# Altium schematic sheet Game_Consol_Power.SchDoc: Schematic_Name
size A4; CompanyName: University of Melbourne; DrawnBy: Student_#; Engineer: Your Name Here; Organization: University of Melbourne; DocumentNumber: 1; Revision: 0.1; SheetNumber: 1; SheetTotal: 10; Title_Project: Project_Title
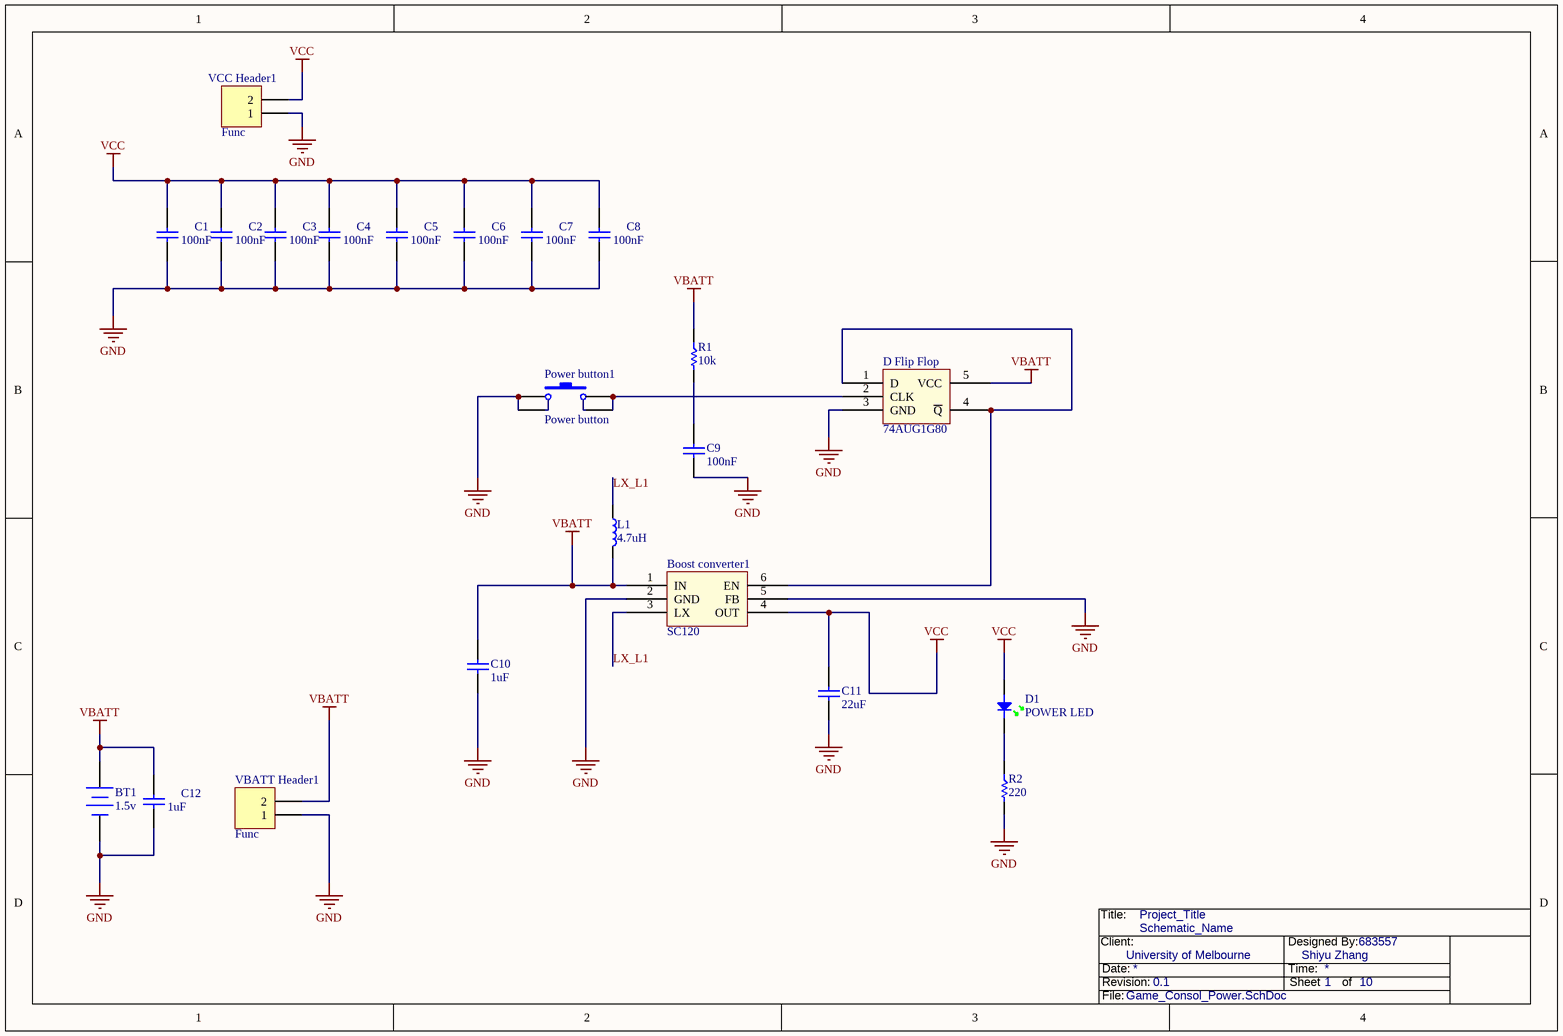
[diagram p0: Game_Consol_Power.SchDoc]

## Parts
Boost_converter1  SC120  [SOT23-6]
BT1  1.5v  [BATT_HOLDER]
C1  100nF  [0805]
C2  100nF  [0805]
C3  100nF  [0805]
C4  100nF  [0805]
C5  100nF  [0805]
C6  100nF  [0805]
C7  100nF  [0805]
C8  100nF  [0805]
C9  100nF  [0805]
C10  1uF  [0805]
C11  22uF  [1210]
C12  1uF  [0805]
D1  POWER LED  [0805D]
D_Flip_Flop  74AUG1G80  [SOT23-5]
L1  4.7uH  [1210L]
Power_button1  Power button  [SPNO_SMD]
R1  10k  [0805]
R2  220  [0805]
VBATT_Header1  Func  [HDR1X2]
VCC_Header1  Func  [HDR1X2]

## Nets
GND: Boost_converter1.2(GND) Boost_converter1.5(FB) BT1.2(-) C1.2 C2.2 C3.2 C4.2 C5.2 C6.2 C7.2 C8.2 C9.2 C10.2 C11.2 C12.2 D_Flip_Flop.3(GND) Power_button1.1 Power_button1.2 R2.2 VBATT_Header1.1 VCC_Header1.1
VBATT: Boost_converter1.1(IN) BT1.1(+) C10.1 C12.1 D_Flip_Flop.5(VCC) L1.2 R1.1 VBATT_Header1.2
VCC: Boost_converter1.4(OUT) C1.1 C2.1 C3.1 C4.1 C5.1 C6.1 C7.1 C8.1 C11.1 D1.A VCC_Header1.2
LX_L1: Boost_converter1.3(LX) L1.1
NetBoost_converter1_6: Boost_converter1.6(EN) D_Flip_Flop.1(D) D_Flip_Flop.4(~{Q})
NetC9_1: C9.1 R1.2
NetD1_K: D1.K R2.1
NetD_Flip_Flop_2: D_Flip_Flop.2(CLK) Power_button1.3 Power_button1.4

## Notes on the sheet
- Title:
- Client:
- Date:
- Revision:
- Time:
- Designed By:
- Sheet
- Shiyu Zhang
- of
- 683557
- File:

## Library data of the parts
Boost_converter1 = SC120: Regulator Low Voltage
BT1 = BAT: Battery Holder AA 1.5v; Published: 24-Mar-1999; LatestRevisionDate: 17-Jul-2002; LatestRevisionNote: Re-released for DXP Platform.; PackageReference: BAT-2; Publisher: Altium Limited; PackageDescription: Battery; 2 Leads
C1-C10 C12 = C 0805: Capacitor 100nF; Class I: Passive; Revision: July-2002: Re-released for DXP Platform.
  C1-C9: Value: 100nF
  C10 C12: Value: 1uF
C11 = C 1210: Capacitor 22uF; Manufacturer: Generic Components; Manufacturer Part Number: LMK316F226ZL-T; Class I: Passive; Capacitance: 22µF; Voltage - Rated: 10V; Tolerance: -20%, +80%; Temperature Coefficient: Y5V (F); Published: 8-Jun-2000; Revision: July-2002: Re-released for DXP Platform.; Publisher: Altium Limited; Class II: Capacitor; Supplier 1: Digi-Key; RoHS: RoHS Compliant; Category: Capacitors; Stock 1: 33004; Pricing 1: 1=0.3, 10=0.254, 50=0.143, 100=0.1271, 250=0.09532, 500=0.08418, 1000=0.07465 (AUD); Mounting Type: Surface Mount, MLCC; Operating Temperature: -30°C ~ 85°C; Applications: General Purpose; Ratings: -; Package / Case: 1206 (3216 Metric); Size / Dimension: 0.126" L x 0.063" W (3.20mm x 1.60mm); Height - Seated (Max): -; Thickness (Max): 0.071" (1.80mm); Lead Spacing: -; Features: -; Packaging: Cut Tape (CT); Lead Style: -; ComponentLink1URL: http://www.yuden.co.jp/or/product/category/capacitor/LMK316F226ZL-T.pdf; ComponentLink1Description: http://www.yuden.co.jp/or/product/category/capacitor/LMK316F226ZL-T.pdf; Supplier Part Number 1: 587-1356-1-ND; Value: 22uF
D1 = LED GREEN: Light Emitting Diode; Manufacturer: Generic Components; Class I: Discrete; Class II: Diode - Switching; Published: 8-Jun-2000; Revision: July-2002: Re-released for DXP Platform.; Publisher: Altium Limited
D_Flip_Flop = 74AUG1G80: Inverted single D flip flop
L1 = I 1210: Inductor 4.7uH; Manufacturer: Murata Electronics North America; Manufacturer Part Number: LQH32CN4R7M23L; Code_IEC: 1005; Inductance: 4.7µH; Current: 450mA; Type: Ferrite Core; Tolerance: ±20%; Shielding: Unshielded; DC Resistance (DCR): 260 mOhm Max; Frequency - Self Resonant: 43MHz; Material - Core: Ferrite; Frequency - Test: 1MHz; Published: 8-Jun-2000; LatestRevisionDate: 17-Jul-2002; LatestRevisionNote: Re-released for DXP Platform.; PackageReference: 0402-A; Publisher: Altium Limited; Code_JEITA: 0402; Class II: Inductor; Supplier 1: Digi-Key; RoHS: RoHS Compliant; Category: Inductors, Coils, Chokes; Stock 1: 31057; Pricing 1: 1=0.34, 10=0.313, 25=0.2784, 50=0.2436, 100=0.2261, 250=0.20868, 500=0.19824, 750=0.18084, 1000=0.15998 (AUD); Current - Saturation: -; Current - Temperature Rise: -; Q @ Freq: -; Applications: Power Supplies; Package / Case: 1210 (3225 Metric); Mounting Type: Surface Mount; Packaging: Cut Tape (CT); Operating Temperature: -40°C ~ 85°C; ComponentLink1URL: http://search.murata.co.jp/Ceramy/image/img/PDF/ENG/L0075S0093LQH32C_23~33.pdf; ComponentLink1Description: http://search.murata.co.jp/Ceramy/image/img/PDF/ENG/L0075S0093LQH32C_23~33.pdf; Supplier Part Number 1: 490-2495-1-ND; Value: 4.7uH
Power_button1 = SW-PB: Push Button Switch; Manufacturer: TE Connectivity; Manufacturer Part Number: FSM4JSMA; Circuit: SPST-NO; Switch Function: Off-Mom; Contact Rating @ Voltage: 0.05A @ 12VDC; Actuator Type: Standard; Actuator Orientation: Top Actuated; Outline: 6.00mm x 6.00mm; Illumination: Non-Illuminated; Operating Force: 160gf; Published: 24-Mar-1999; LatestRevisionDate: 17-Jul-2002; LatestRevisionNote: Re-released for DXP Platform.; PackageReference: SPST-2; Publisher: Altium Limited; PackageDescription: Switch; 2 Leads; Supplier 1: Digi-Key; RoHS: RoHS Compliant; Category: Switches; Stock 1: 30338; Pricing 1: 1=0.28, 10=0.265, 25=0.2256, 50=0.1974, 100=0.1834, 250=0.1622, 500=0.15516, 1000=0.12694, 5000=0.10579 (AUD); Mounting Type: Surface Mount; Termination Style: Gull Wing; Packaging: Bulk; ComponentLink1URL: http://documents.tycoelectronics.com/commerce/DocumentDelivery/DDEController?Action=srchrtrv&DocNm=2-1437565-7&DocType=CD&DocLang=EN; ComponentLink1Description: http://documents.tycoelectronics.com/commerce/DocumentDelivery/DDEController?Action=srchrtrv&DocNm=2-1437565-7&DocType=CD&DocLang=EN; Supplier Part Number 1: 450-1129-ND
R1 R2 = R: Resistor
  R1: Value: 10k
  R2: Value: 220
VBATT_Header1 VCC_Header1 = HDR2: 2 Pin Header; LatestRevisionDate: 17-Jul-2002; LatestRevisionNote: Re-released for DXP Platform.; Publisher: Altium Limited